# Altium schematic sheet WAFC.SchDoc
size A3
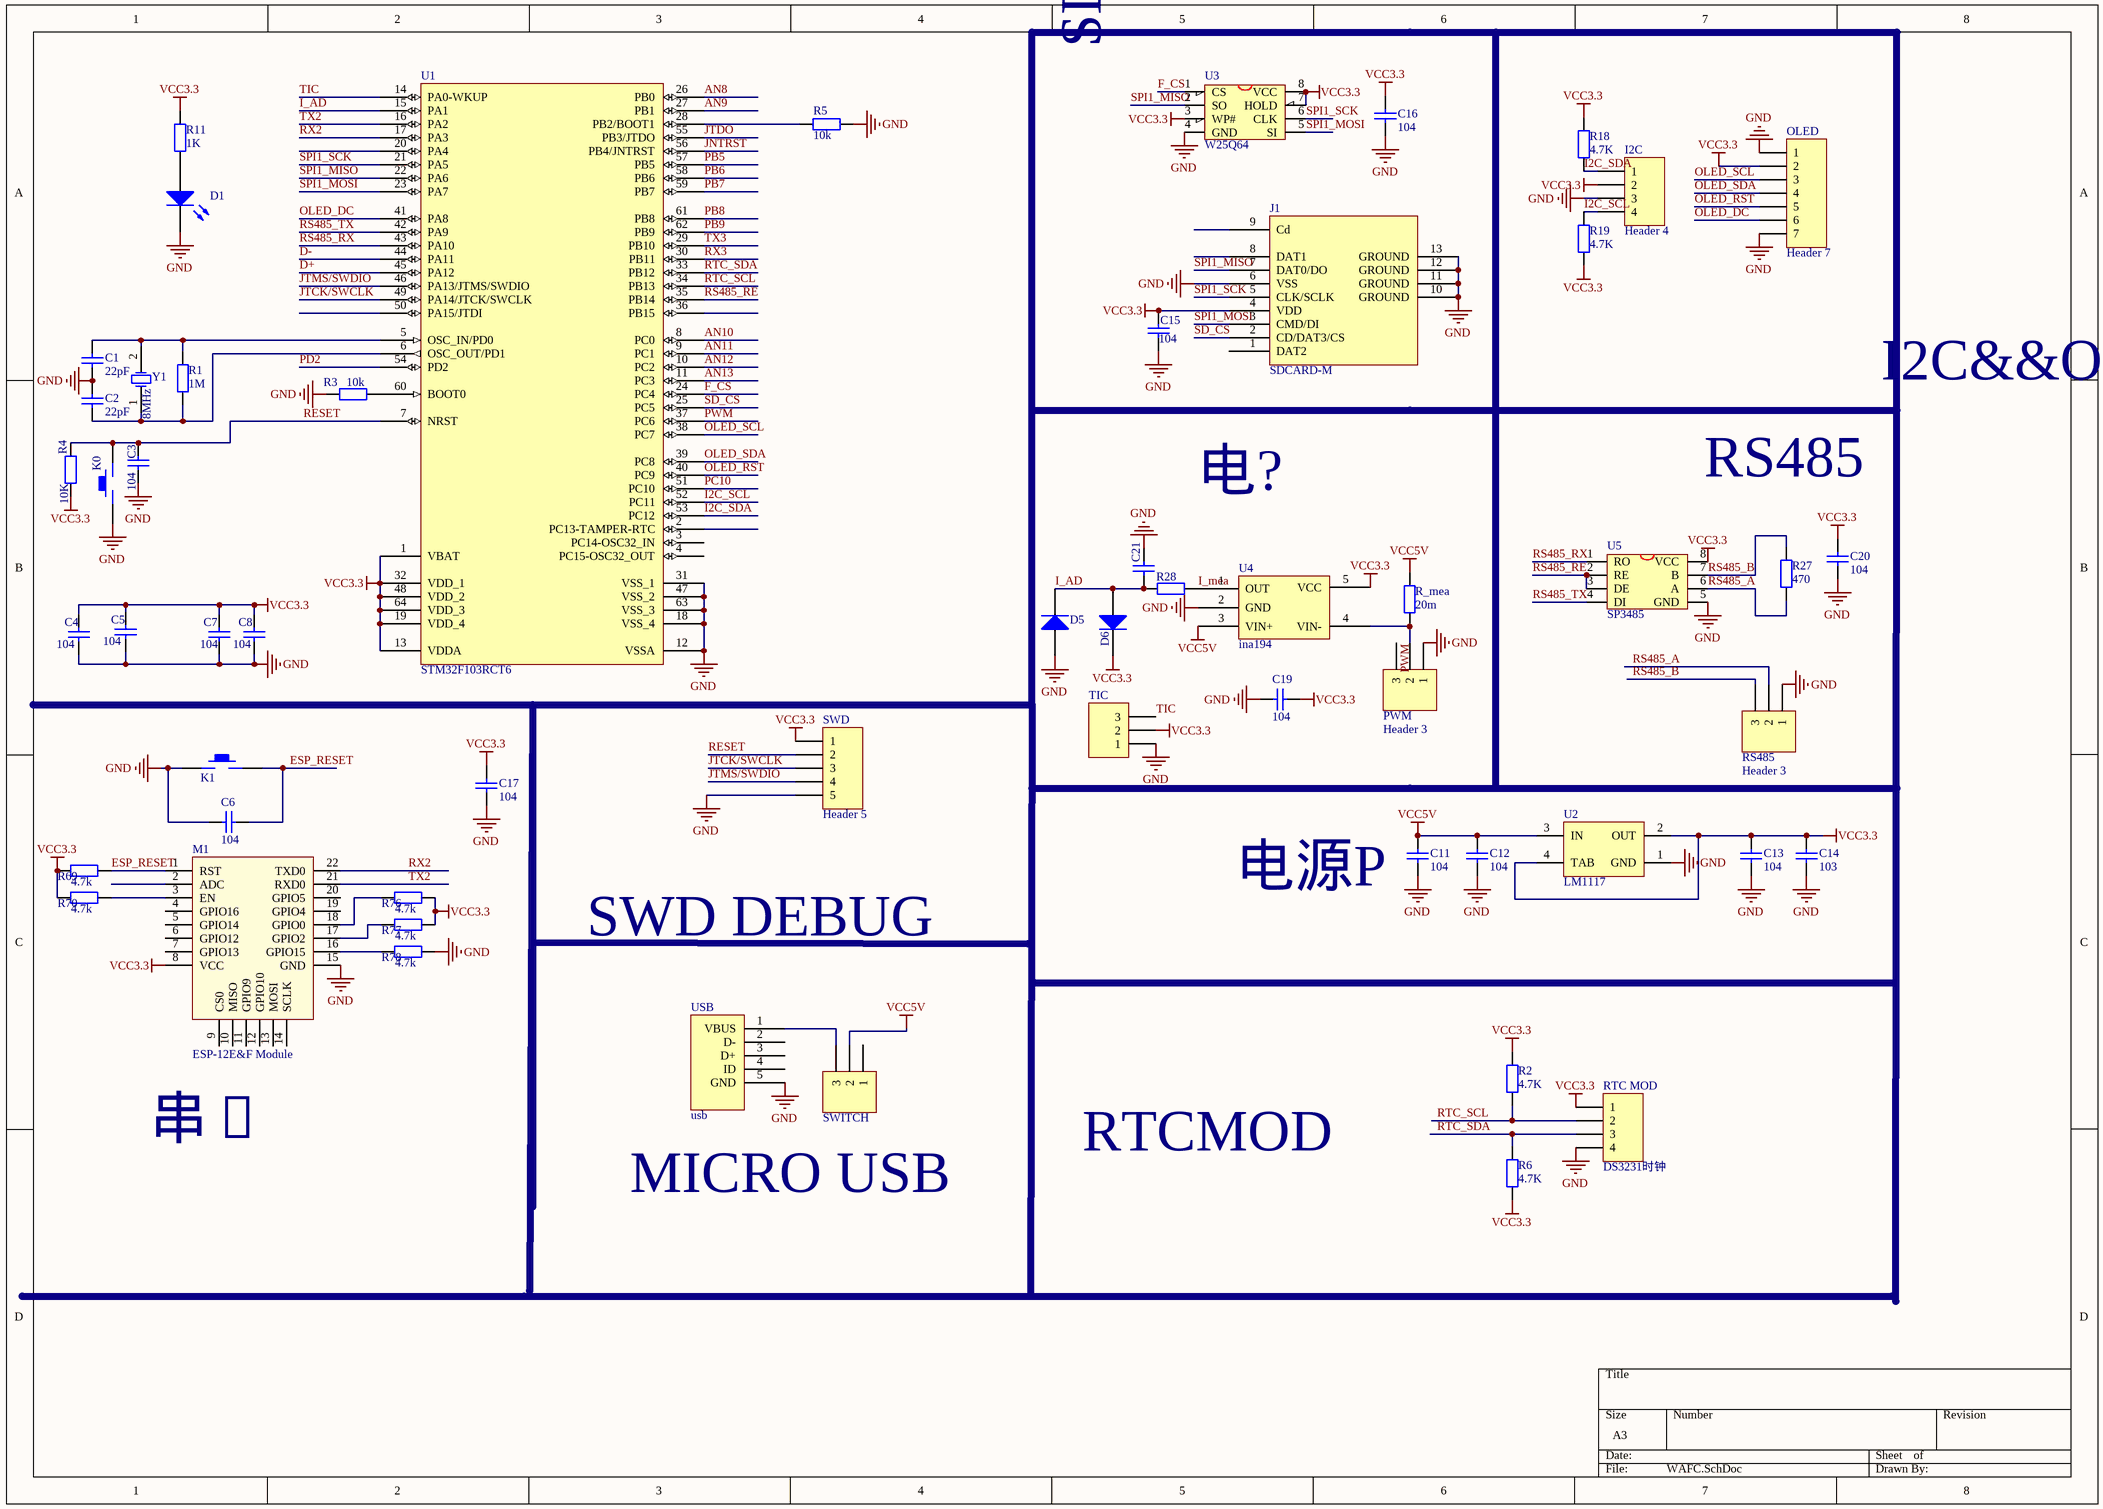
[diagram p0: WAFC.SchDoc]

## Parts
C1  value 22pF  [0603]  (hidden comment: Cap)
C2  value 22pF  [0603]  (hidden comment: Cap)
C3  value 104  [0603]  (hidden comment: Cap)
C4  value 104  [0603]  (hidden comment: Cap)
C5  value 104  [0603]  (hidden comment: Cap)
C6  value 104  [0603]  (hidden comment: Cap)
C7  value 104  [0603]  (hidden comment: Cap)
C8  value 104  [0603]  (hidden comment: Cap)
C11  value 104  [0603]  (hidden comment: Cap)
C12  value 104  [0603]  (hidden comment: Cap)
C13  value 104  [0603]  (hidden comment: Cap)
C14  value 103  [0603]  (hidden comment: Cap)
C15  value 104  [0603]  (hidden comment: Cap)
C16  value 104  [0603]  (hidden comment: Cap)
C17  value 104  [0603]  (hidden comment: Cap)
C19  value 104  [0603]  (hidden comment: Cap)
C20  value 104  [0603]  (hidden comment: Cap)
C21  Cap  [0603]  (value not drawn)
D1  LED2  [0603]  (value not drawn)
D5  SS14  [IN5819]  (value not drawn)
D6  SS14  [IN5819]  (value not drawn)
I2C  Header 4  [HDR1X4]
J1  SDCARD-M  [SDCARD-M]
K0  K1  [sop2]  (value not drawn)
K1  K1  [sop2]  (value not drawn)
M1  ESP-12E&F Module  [ESP-12E&F Module]
OLED  Header 7  [HDR1X7]
PWM  Header 3  [HDR1X3]
R1  value 1M  [0603]  (hidden comment: Res2)
R2  value 4.7K  [0603]  (hidden comment: Res2)
R3  value 10k  [0603]  (hidden comment: Res2)
R4  value 10K  [0603]  (hidden comment: Res2)
R5  value 10k  [0603]  (hidden comment: Res2)
R6  value 4.7K  [0603]  (hidden comment: Res2)
R11  value 1K  [0603]  (hidden comment: Res2)
R18  value 4.7K  [0603]  (hidden comment: Res2)
R19  value 4.7K  [0603]  (hidden comment: Res2)
R27  value 470  [0603]  (hidden comment: Res2)
R28  Res2  [0603]  (value not drawn)
R69  value 4.7k  [0603]  (hidden comment: Res2)
R70  value 4.7k  [0603]  (hidden comment: Res2)
R76  value 4.7k  [0603]  (hidden comment: Res2)
R77  value 4.7k  [0603]  (hidden comment: Res2)
R78  value 4.7k  [0603]  (hidden comment: Res2)
R_mea  value 20m  [0805]  (hidden comment: Res2)
RS485  Header 3  [DZ3*3.5]
RTC_MOD  DS3231时钟  [HDR1X4]
SWD  Header 5  [HDR1X5]
SWITCH  Header 3  [12D00]  (value not drawn)
TIC  Header 3  [DZ3*3.5]  (value not drawn)
U1  STM32F103RCT6  [LQFP64]
U2  LM1117  [MP04A_N]
U3  W25Q64  [SOIC-8]
U4  ina194  [ina194]
U5  SP3485  [SOP-8]
USB  usb  [Micro_USB]
Y1  8MHz  [XTAL_US]

## Nets
GND: C1.1 C2.2 C3.1 C4.2 C5.2 C6.2 C7.2 C8.2 C11.1 C12.1 C13.1 C14.1 C15.1 C16.1 C17.1 C19.1 C20.1 C21.2 D1.2(K) D5.1(A) I2C.3 J1.6(VSS) J1.10(GROUND) J1.11(GROUND) J1.12(GROUND) J1.13(GROUND) K0.1 K1.1 M1.15(GND) OLED.1 OLED.7 PWM.1 R3.2 R5.1 R78.1 RS485.1 RTC_MOD.4 SWD.5 TIC.1 U1.12(VSSA) U1.18(VSS_4) U1.31(VSS_1) U1.47(VSS_2) U1.63(VSS_3) U2.1(GND) U3.4(GND) U4.2(GND) U5.5(GND) USB.5(GND)
VCC3.3: C4.1 C5.1 C7.1 C8.1 C13.2 C14.2 C15.2 C16.2 C17.2 C19.2 C20.2 D6.2(K) I2C.2 J1.4(VDD) M1.8(VCC) OLED.2 R2.1 R4.1 R6.2 R11.2 R18.1 R19.2 R69.2 R70.2 R76.1 R77.1 RTC_MOD.1 SWD.1 TIC.2 U1.1(VBAT) U1.13(VDDA) U1.19(VDD_4) U1.32(VDD_1) U1.48(VDD_2) U1.64(VDD_3) U2.2(OUT) U2.4(TAB) U3.3(WP#) U3.7(HOLD) U3.8(VCC) U4.5(VCC) U5.8(VCC)
VCC5V: C11.2 C12.2 R_mea.2 SWITCH.2 U2.3(IN) U4.3(VIN+)
AN8: U1.26(PB0)
AN9: U1.27(PB1)
AN10: U1.8(PC0)
AN11: U1.9(PC1)
AN12: U1.10(PC2)
AN13: U1.11(PC3)
D+: U1.45(PA12)
D-: U1.44(PA11)
ESP_RESET: C6.1 K1.2 M1.1(RST) R69.1
F_CS: U1.24(PC4) U3.1(CS)
I2C_SCL: I2C.4 R19.1 U1.52(PC11)
I2C_SDA: I2C.1 R18.2 U1.53(PC12)
I_AD: C21.1 D5.2(K) D6.1(A) R28.1 U1.15(PA1)
I_mea: R28.2 U4.1(OUT)
JNTRST: U1.56(PB4/JNTRST)
JTCK/SWCLK: SWD.3 U1.49(PA14/JTCK/SWCLK)
JTDO: U1.55(PB3/JTDO)
JTMS/SWDIO: SWD.4 U1.46(PA13/JTMS/SWDIO)
OLED_DC: OLED.6 U1.41(PA8)
OLED_RST: OLED.5 U1.40(PC9)
OLED_SCL: OLED.3 U1.38(PC7)
OLED_SDA: OLED.4 U1.39(PC8)
PB5: U1.57(PB5)
PB6: U1.58(PB6)
PB7: U1.59(PB7)
PB8: U1.61(PB8)
PB9: U1.62(PB9)
PC10: U1.51(PC10)
PD2: U1.54(PD2)
PWM: PWM.3 U1.37(PC6)
RESET: C3.2 K0.2 R4.2 SWD.2 U1.7(NRST)
RS485_A: R27.2 RS485.2 U5.6(A)
RS485_B: R27.1 RS485.3 U5.7(B)
RS485_RE: U1.35(PB14) U5.2(RE) U5.3(DE)
RS485_RX: U1.43(PA10) U5.1(RO)
RS485_TX: U1.42(PA9) U5.4(DI)
RTC_SCL: R2.2 RTC_MOD.2 U1.34(PB13)
RTC_SDA: R6.1 RTC_MOD.3 U1.33(PB12)
RX2: M1.22(TXD0) U1.17(PA3)
RX3: U1.30(PB11)
SD_CS: J1.2(CD/DAT3/CS) U1.25(PC5)
SPI1_MISO: J1.7(DAT0/DO) U1.22(PA6) U3.2(SO)
SPI1_MOSI: J1.3(CMD/DI) U1.23(PA7) U3.5(SI)
SPI1_SCK: J1.5(CLK/SCLK) U1.21(PA5) U3.6(CLK)
TIC: TIC.3 U1.14(PA0-WKUP)
TX2: M1.21(RXD0) U1.16(PA2)
TX3: U1.29(PB10)
NetC1_2: C1.2 R1.2 U1.5(OSC_IN/PD0) Y1.2(OSC2)
NetC2_1: C2.1 R1.1 U1.6(OSC_OUT/PD1) Y1.1(OSC1)
NetD1_1: D1.1(A) R11.1
NetM1_3: M1.3(EN) R70.1
NetM1_16: M1.16(GPIO15) R78.2
NetM1_17: M1.17(GPIO2) R77.2
NetM1_18: M1.18(GPIO0) R76.2
NetPWM_2: PWM.2 R_mea.1 U4.4(VIN-)
NetR3_1: R3.1 U1.60(BOOT0)
NetR5_2: R5.2 U1.28(PB2/BOOT1)
NetSWITCH_3: SWITCH.3 USB.1(VBUS)

Not connected (* = marked no-connect by the designer): J1 1(DAT2) 8(DAT1) 9(Cd); M1 2(ADC) 4(GPIO16) 5(GPIO14) 6(GPIO12) 7(GPIO13) 9(CS0) 10(MISO) 11(GPIO9) 12(GPIO10) 13(MOSI) 14(SCLK) 19(GPIO4) 20(GPIO5); SWITCH 1; U1 2(PC13-TAMPER-RTC) 3(PC14-OSC32_IN) 4(PC15-OSC32_OUT) 20(PA4) 36(PB15) 50(PA15/JTDI); USB 2(D-) 3(D+) 4(ID)

## Notes on the sheet
- (near C15) SD卡&&Flash
- I2C&&OLED
- 电?
- RS485
- (near C11) 电源P
- SWD DEBUG
- 串�
- RTCMOD
- MICRO USB

## Library data of the parts
C1-C8 C11-C17 C19-C21 = Cap: Capacitor; Published: 8-Jun-2000; LatestRevisionDate: 17-Jul-2002; LatestRevisionNote: Re-released for DXP Platform.; PackageReference: RAD-0.3; Publisher: Altium Limited
D1 = LED2: Typical RED, GREEN, YELLOW, AMBER GaAs LED; Published: 8-Jun-2000; LatestRevisionDate: 17-Jul-2002; LatestRevisionNote: Re-released for DXP Platform.; PackageDocument: Feb-2002; PackageReference: 3.2X1.6X1.1; Publisher: Altium Limited
D5 D6 = Diode 1N4007: 1 Amp General Purpose Rectifier; Published: 8-Jun-2000; LatestRevisionDate: 17-Jul-2002; LatestRevisionNote: Re-released for DXP Platform.; DatasheetDocument: 1998; PackageDocument: Aug-1999; PackageReference: DO-41; Publisher: Altium Limited; Code_JEDEC: DO-204-AL; ComponentLink1Description: Manufacturer Link; ComponentLink1URL: http://www.fairchildsemi.com/; ComponentLink2Description: Datasheet; ComponentLink2URL: http://www.fairchildsemi.com/ds/1N%2F1N4001.pdf
I2C RTC_MOD = Header 4: Header, 4-Pin; LatestRevisionDate: 17-Jul-2002; LatestRevisionNote: Re-released for DXP Platform.; Publisher: Altium Limited
J1 = SDC: TF卡槽
K0 K1 = KEY
OLED = Header 7: Header, 7-Pin; LatestRevisionDate: 17-Jul-2002; LatestRevisionNote: Re-released for DXP Platform.; Publisher: Altium Limited
PWM RS485 SWITCH TIC = Header 3: Header, 3-Pin; LatestRevisionDate: 17-Jul-2002; LatestRevisionNote: Re-released for DXP Platform.; Publisher: Altium Limited
R1-R6 R11 R18 R19 R27 R28 R_mea = Res2: Resistor; Published: 8-Jun-2000; LatestRevisionDate: 17-Jul-2002; LatestRevisionNote: Re-released for DXP Platform.; PackageReference: AXIAL-0.4; Publisher: Altium Limited
R69 R70 R76-R78 = RES
SWD = Header 5: Header, 5-Pin; LatestRevisionDate: 17-Jul-2002; LatestRevisionNote: Re-released for DXP Platform.; Publisher: Altium Limited
U1 = STM32F103RBT6: STM32 ARM-based 32-bit MCU with 128 Kbytes Flash, 64-pin LQFP, Industrial Temperature; Published: 30-May-2008; DatasheetVersion: rev6, Mar-2008; PackageVersion: Mar-2008; PackageReference: LQFP64; Publisher: Altium Limited; PackageDescription: 64-Pin Low-Profile Quad Flat Pack, 10 x 10 mm Body, 0.5 mm Pitch (LQFP64); ComponentLink1Description: Manufacturer Link; ComponentLink1URL: www.st.com/stm32; ComponentLink2Description: Datasheet; ComponentLink2URL: http://www.st.com/stonline/products/literature/ds/13587.pdf
U2 = LM1117: 800mA LDO; PartNumber: LM1117IMP-5.0; Manufacturer: National Semiconductor; CompType: LDO IC; PackageTopMarking: XYTT*N06B; Published: 4-Dec-2008; DatasheetVersion: Apr-2006; PackageVersion: revB, Apr-2003; PackageReference: MP04A; Publisher: Altium Limited; PackageDescription: Molded SOT-223, 6.50 x 3.56 x 1.6mm Body, 4 Lead, 2.3mm Pitch; RoHS: O; PinCount: 4; DigiKeyPartNumber: LM1117IMP-5.0CT-ND; Code_JEDEC: TO-261-AA; Code_IPC: SOT223-4; ComponentLink1Description: LM1117 Datasheet; ComponentLink1URL: http://www.national.com/ds/LM/LM1117.pdf; ComponentLink2Description: LM1117 Web Page; ComponentLink2URL: http://www.national.com/pf/LM/LM1117.html; ComponentLink3Description: MP04A Package Page; ComponentLink3URL: http://www.national.com/packaging/folders/mp04a.html
U3 = W25X16: W25X16;SST25VF016;MX25L1605
U5 = MAX3485
Y1 = XTAL: Crystal Oscillator; Published: 8-Jun-2000; LatestRevisionDate: 17-Jul-2002; LatestRevisionNote: Re-released for DXP Platform.; Publisher: Altium Limited